# Altium project FMC_ADC_100M_10B_16CHA_TDC.PrjPCB (part 1 of 4)
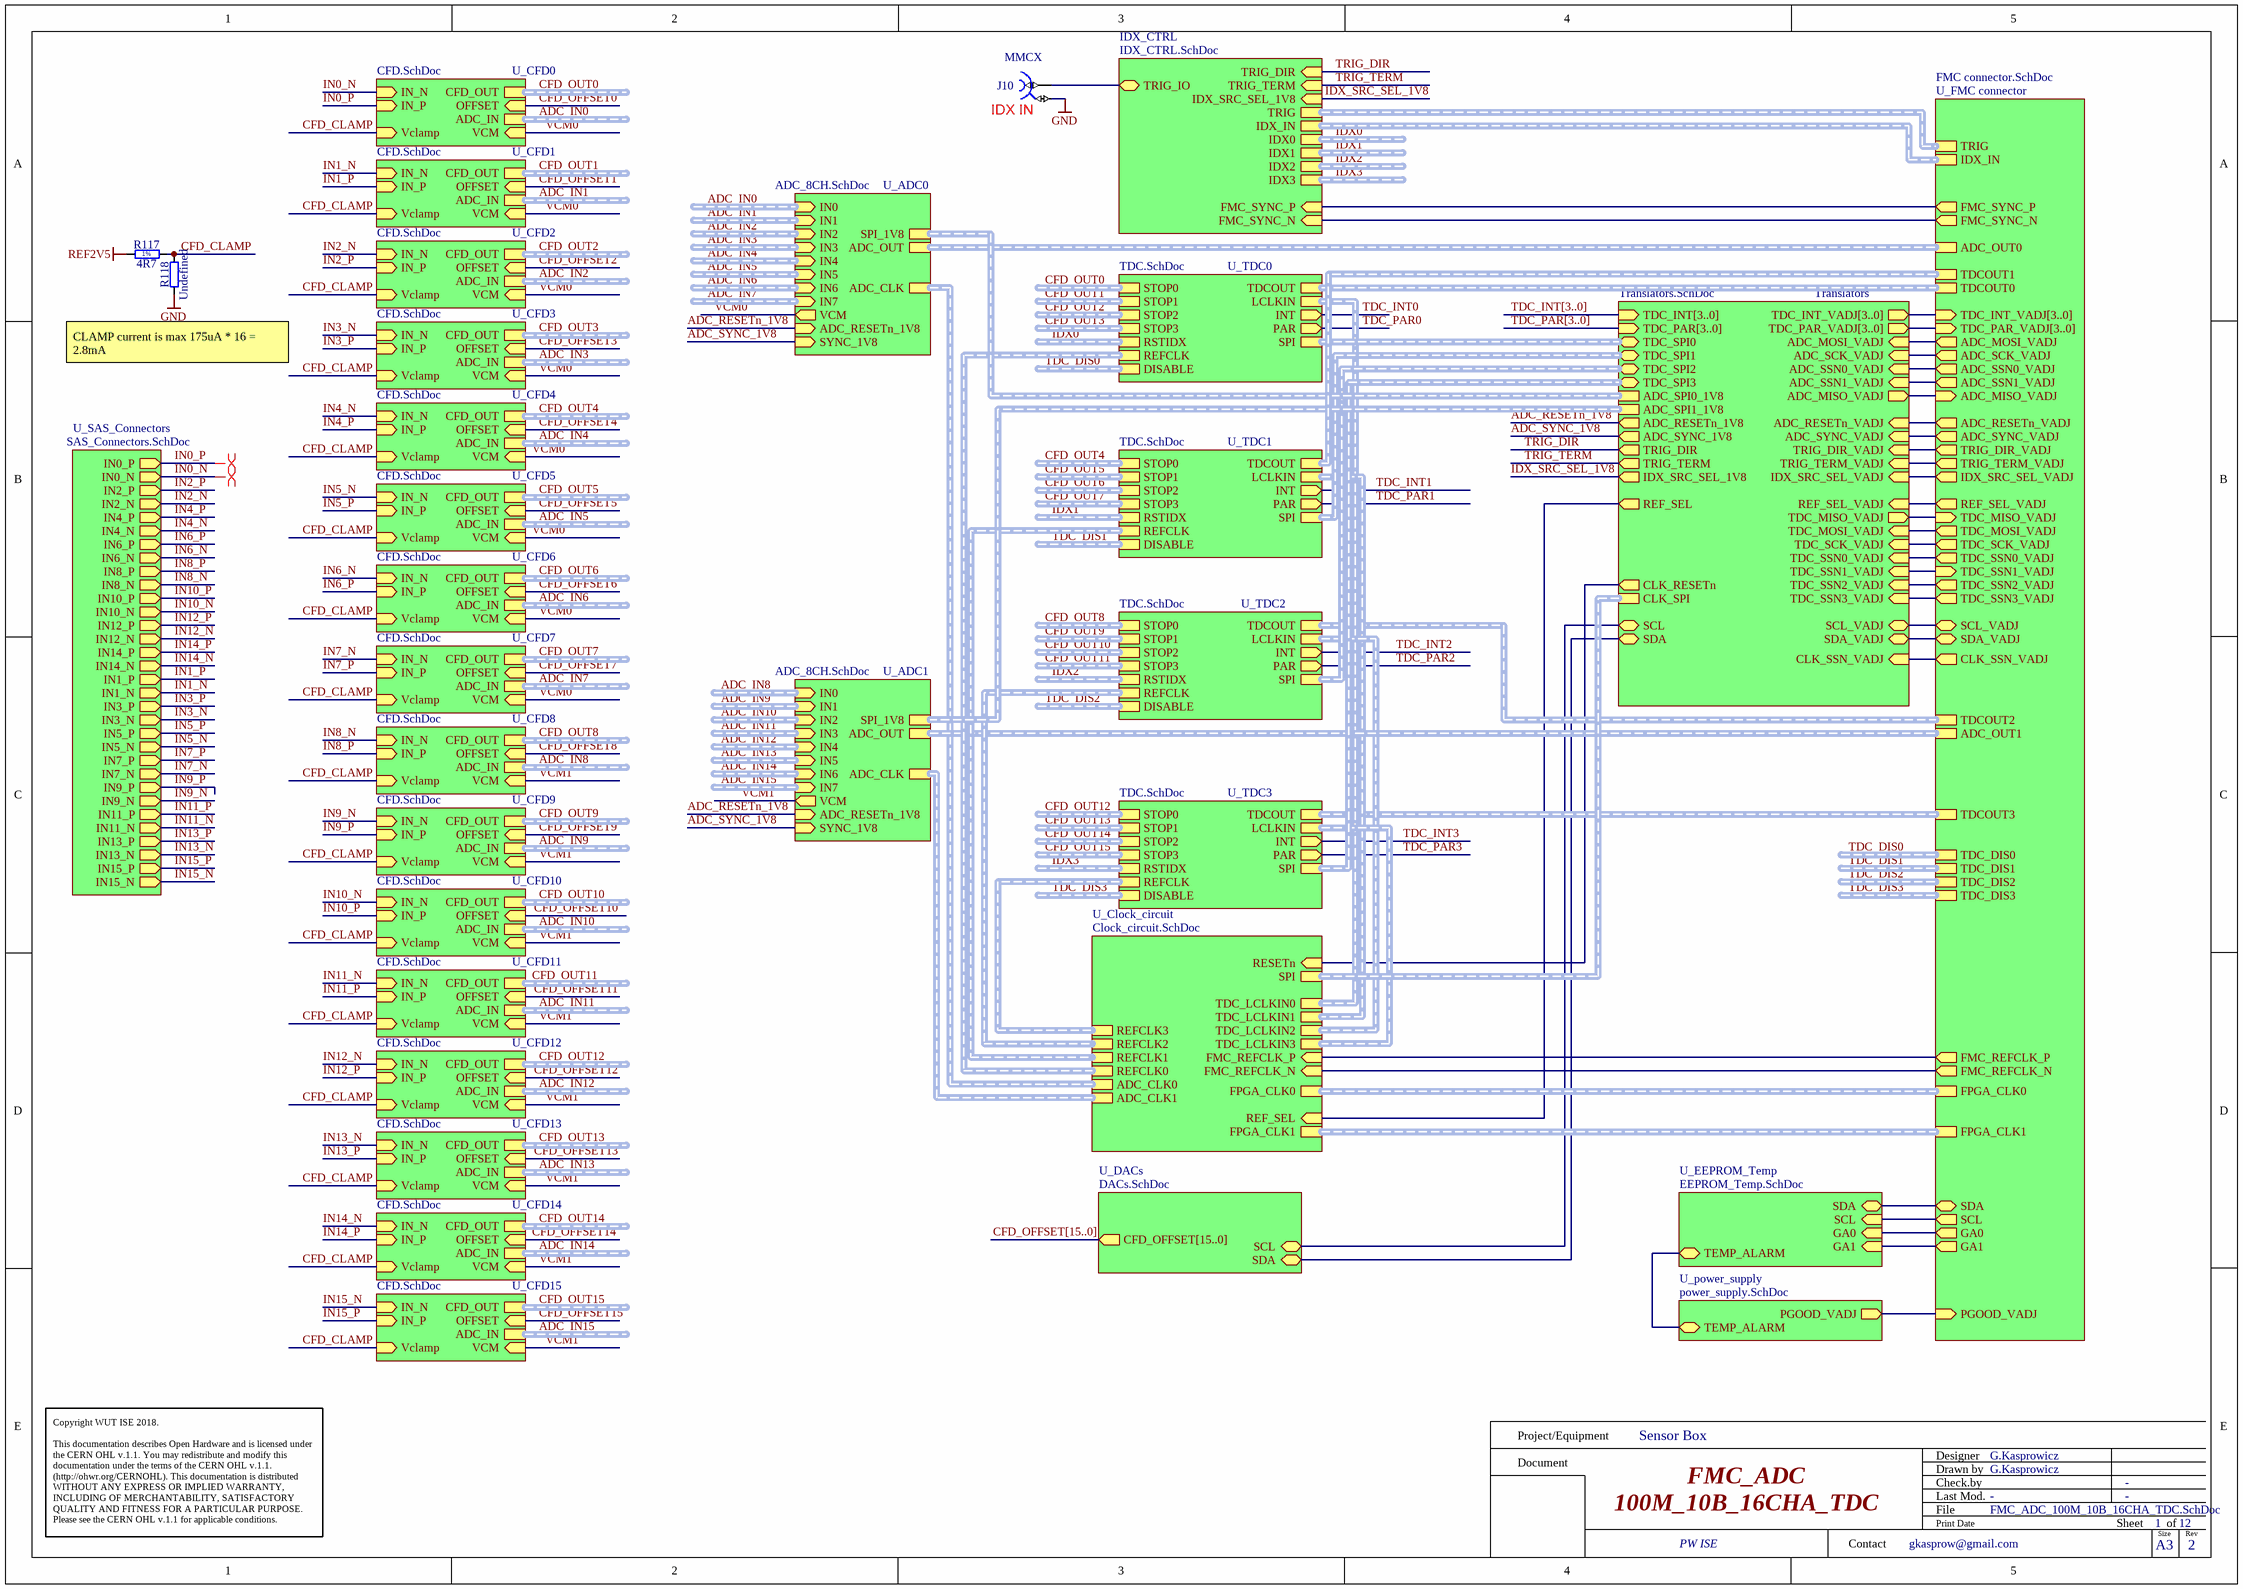
[diagram p0: FMC_ADC_100M_10B_16CHA_TDC.SchDoc]
12 sheets, 720 parts. Net scope: hierarchical (ports join the sheet entries above them; power ports are global).
Board file: FMC_ADC_100M_10B_16CHA_TDC.PcbDoc
Sheets:
  FMC_ADC_100M_10B_16CHA_TDC.SchDoc
    U_ADC0 = ADC_8CH.SchDoc
    U_TDC0 = TDC.SchDoc
    U_Clock_circuit = Clock_circuit.SchDoc
    U_EEPROM_Temp = EEPROM_Temp.SchDoc
    U_FMC connector = FMC connector.SchDoc
    U_power_supply = power_supply.SchDoc
    IDX_CTRL = IDX_CTRL.SchDoc
    U_TDC1 = TDC.SchDoc
    U_TDC2 = TDC.SchDoc
    U_TDC3 = TDC.SchDoc
    U_CFD0 = CFD.SchDoc
    U_DACs = DACs.SchDoc
    U_CFD1 = CFD.SchDoc
    U_CFD2 = CFD.SchDoc
    U_CFD3 = CFD.SchDoc
    U_CFD4 = CFD.SchDoc
    U_CFD5 = CFD.SchDoc
    U_CFD6 = CFD.SchDoc
    U_CFD7 = CFD.SchDoc
    U_CFD8 = CFD.SchDoc
    U_CFD9 = CFD.SchDoc
    U_CFD10 = CFD.SchDoc
    U_CFD11 = CFD.SchDoc
    U_CFD12 = CFD.SchDoc
    U_CFD13 = CFD.SchDoc
    U_CFD14 = CFD.SchDoc
    U_CFD15 = CFD.SchDoc
    U_ADC1 = ADC_8CH.SchDoc
    Translators = Translators.SchDoc
    U_SAS_Connectors = SAS_Connectors.SchDoc

## Sheet FMC_ADC_100M_10B_16CHA_TDC.SchDoc: FMC_ADC
size 420 x 297 mm; Author: G.Kasprowicz; CompanyName: WUT ISE; DrawnBy: G.Kasprowicz; Organization: WUT ISE; Address1: PW ISE; Address2: Nowowiejska 15/19 00-665 Warsaw; Address3: gkasprow@gmail.com; DocumentNumber: 1; Revision: 2; SheetNumber: 1; SheetTotal: 12; ModifiedBy: -; CheckedDate: -; Title2: 100M_10B_16CHA_TDC; DivGrp: WUT ISE; Designer: G.Kasprowicz; ModifiedDate: -; ProjectName: Sensor Box

### Parts
J10  Family: MMCX  [HUBER-SUHNER_85_MMCX-50-0-1/111 OH]  (hidden comment: Coax_1Female_1Shield)
R117  4R7  [RESC1005X40N]
R118  Undefined  [RESC1005X40N]

### Sub-sheets
IDX_CTRL = IDX_CTRL.SchDoc: TRIG_DIR (in), TRIG_TERM (in), IDX1 (harness DIFFSIG), IDX_IN (harness DIFFSIG), IDX2 (harness DIFFSIG), IDX0 (harness DIFFSIG), IDX3 (harness DIFFSIG), TRIG (harness DIFFSIG), TRIG_IO (bidir), IDX_SRC_SEL_1V8 (in), FMC_SYNC_P (in), FMC_SYNC_N (in)
Translators = Translators.SchDoc: TDC_SPI0 (bidir, harness SPI), TDC_SPI1 (bidir, harness SPI), TDC_SPI2 (bidir, harness SPI), TDC_SPI3 (bidir, harness SPI), ADC_SPI0_1V8 (harness SPI), ADC_SPI1_1V8 (harness SPI), ADC_RESETn_1V8 (out), ADC_SYNC_1V8 (out), TRIG_DIR (out), TRIG_TERM (out), IDX_SRC_SEL_1V8 (out), ADC_RESETn_VADJ (in), ADC_SYNC_VADJ (in), TRIG_DIR_VADJ (in), TRIG_TERM_VADJ (in), IDX_SRC_SEL_VADJ (in), REF_SEL (out), REF_SEL_VADJ (in), ADC_SSN0_VADJ (in), ADC_SSN1_VADJ (in), ADC_MISO_VADJ (out), TDC_MISO_VADJ (out), TDC_MOSI_VADJ (in), TDC_SCK_VADJ (in), TDC_SSN1_VADJ (in), ADC_MOSI_VADJ (in), ADC_SCK_VADJ (in), TDC_SSN0_VADJ (in), TDC_SSN2_VADJ (in), TDC_SSN3_VADJ (in), TDC_INT[3..0] (in), TDC_PAR[3..0] (in), TDC_INT_VADJ[3..0] (out), TDC_PAR_VADJ[3..0] (out), SCL (bidir), SDA (bidir), SCL_VADJ (bidir), SDA_VADJ (bidir), CLK_SPI (harness SPI), CLK_RESETn (out), CLK_SSN_VADJ (in)
U_ADC0 = ADC_8CH.SchDoc: ADC_OUT (harness ADC_OUT), VCM (out), ADC_CLK (harness DIFFCLK), IN0 (in, harness DIFFSIG), IN5 (in, harness DIFFSIG), IN6 (in, harness DIFFSIG), IN7 (in, harness DIFFSIG), IN4 (in, harness DIFFSIG), IN2 (in, harness DIFFSIG), IN3 (in, harness DIFFSIG), IN1 (in, harness DIFFSIG), ADC_RESETn_1V8 (in), SYNC_1V8 (in), SPI_1V8 (harness SPI)
U_ADC1 = ADC_8CH.SchDoc: ADC_OUT (harness ADC_OUT), VCM (out), ADC_CLK (harness DIFFCLK), IN0 (in, harness DIFFSIG), IN5 (in, harness DIFFSIG), IN6 (in, harness DIFFSIG), IN7 (in, harness DIFFSIG), IN4 (in, harness DIFFSIG), IN2 (in, harness DIFFSIG), IN3 (in, harness DIFFSIG), IN1 (in, harness DIFFSIG), ADC_RESETn_1V8 (in), SYNC_1V8 (in), SPI_1V8 (harness SPI)
U_CFD0 = CFD.SchDoc: CFD_OUT (harness DIFFSIG), IN_P (in), OFFSET (in), IN_N (in), VCM (in), Vclamp (in), ADC_IN (harness DIFFSIG)
U_CFD1 = CFD.SchDoc: CFD_OUT (harness DIFFSIG), IN_P (in), OFFSET (in), IN_N (in), VCM (in), Vclamp (in), ADC_IN (harness DIFFSIG)
U_CFD2 = CFD.SchDoc: CFD_OUT (harness DIFFSIG), IN_P (in), OFFSET (in), IN_N (in), VCM (in), Vclamp (in), ADC_IN (harness DIFFSIG)
U_CFD3 = CFD.SchDoc: CFD_OUT (harness DIFFSIG), IN_P (in), OFFSET (in), IN_N (in), VCM (in), Vclamp (in), ADC_IN (harness DIFFSIG)
U_CFD4 = CFD.SchDoc: CFD_OUT (harness DIFFSIG), IN_P (in), OFFSET (in), IN_N (in), VCM (in), Vclamp (in), ADC_IN (harness DIFFSIG)
U_CFD5 = CFD.SchDoc: CFD_OUT (harness DIFFSIG), IN_P (in), OFFSET (in), IN_N (in), VCM (in), Vclamp (in), ADC_IN (harness DIFFSIG)
U_CFD6 = CFD.SchDoc: CFD_OUT (harness DIFFSIG), IN_P (in), OFFSET (in), IN_N (in), VCM (in), Vclamp (in), ADC_IN (harness DIFFSIG)
U_CFD7 = CFD.SchDoc: CFD_OUT (harness DIFFSIG), IN_P (in), OFFSET (in), IN_N (in), VCM (in), Vclamp (in), ADC_IN (harness DIFFSIG)
U_CFD8 = CFD.SchDoc: CFD_OUT (harness DIFFSIG), IN_P (in), OFFSET (in), IN_N (in), VCM (in), Vclamp (in), ADC_IN (harness DIFFSIG)
U_CFD9 = CFD.SchDoc: CFD_OUT (harness DIFFSIG), IN_P (in), OFFSET (in), IN_N (in), VCM (in), Vclamp (in), ADC_IN (harness DIFFSIG)
U_CFD10 = CFD.SchDoc: CFD_OUT (harness DIFFSIG), IN_P (in), OFFSET (in), IN_N (in), VCM (in), Vclamp (in), ADC_IN (harness DIFFSIG)
U_CFD11 = CFD.SchDoc: CFD_OUT (harness DIFFSIG), IN_P (in), OFFSET (in), IN_N (in), VCM (in), Vclamp (in), ADC_IN (harness DIFFSIG)
U_CFD12 = CFD.SchDoc: CFD_OUT (harness DIFFSIG), IN_P (in), OFFSET (in), IN_N (in), VCM (in), Vclamp (in), ADC_IN (harness DIFFSIG)
U_CFD13 = CFD.SchDoc: CFD_OUT (harness DIFFSIG), IN_P (in), OFFSET (in), IN_N (in), VCM (in), Vclamp (in), ADC_IN (harness DIFFSIG)
U_CFD14 = CFD.SchDoc: CFD_OUT (harness DIFFSIG), IN_P (in), OFFSET (in), IN_N (in), VCM (in), Vclamp (in), ADC_IN (harness DIFFSIG)
U_CFD15 = CFD.SchDoc: CFD_OUT (harness DIFFSIG), IN_P (in), OFFSET (in), IN_N (in), VCM (in), Vclamp (in), ADC_IN (harness DIFFSIG)
U_Clock_circuit = Clock_circuit.SchDoc: FMC_REFCLK_P (in), FMC_REFCLK_N (in), TDC_LCLKIN0 (harness DIFFCLK), TDC_LCLKIN1 (harness DIFFCLK), TDC_LCLKIN2 (harness DIFFCLK), TDC_LCLKIN3 (harness DIFFCLK), ADC_CLK0 (harness DIFFCLK), ADC_CLK1 (harness DIFFCLK), REFCLK0 (harness DIFFCLK), REFCLK1 (harness DIFFCLK), REFCLK2 (harness DIFFCLK), REFCLK3 (harness DIFFCLK), FPGA_CLK0 (harness DIFFCLK), REF_SEL (in), FPGA_CLK1 (harness DIFFCLK), RESETn (in), SPI (harness SPI)
U_DACs = DACs.SchDoc: SDA (bidir), SCL (bidir), CFD_OFFSET[15..0] (out)
U_EEPROM_Temp = EEPROM_Temp.SchDoc: SDA (bidir), SCL (in), GA0 (in), GA1 (in), TEMP_ALARM (bidir)
U_FMC connector = FMC connector.SchDoc: SDA (bidir), GA1 (out), GA0 (out), SCL (out), FMC_REFCLK_P (out), FMC_REFCLK_N (out), TDCOUT0 (harness TDCOUT), TDCOUT1 (harness TDCOUT), TDCOUT2 (harness TDCOUT), TDCOUT3 (harness TDCOUT), ADC_OUT0 (harness ADC_OUT), ADC_OUT1 (harness ADC_OUT), TRIG (harness DIFFSIG), IDX_IN (harness DIFFSIG), FPGA_CLK0 (harness DIFFCLK), FPGA_CLK1 (harness DIFFCLK), ADC_RESETn_VADJ (out), ADC_SYNC_VADJ (out), TRIG_DIR_VADJ (out), TRIG_TERM_VADJ (out), IDX_SRC_SEL_VADJ (out), REF_SEL_VADJ (out), PGOOD_VADJ (in), ADC_MISO_VADJ (in), ADC_MOSI_VADJ (out), ADC_SCK_VADJ (out), ADC_SSN0_VADJ (out), ADC_SSN1_VADJ (out), TDC_MISO_VADJ (in), TDC_MOSI_VADJ (out), TDC_SCK_VADJ (out), TDC_SSN0_VADJ (out), TDC_SSN1_VADJ (in), TDC_SSN2_VADJ (out), TDC_SSN3_VADJ (out), TDC_DIS0 (harness DIFFSIG), TDC_DIS1 (harness DIFFSIG), TDC_DIS2 (harness DIFFSIG), TDC_DIS3 (harness DIFFSIG), TDC_INT_VADJ[3..0] (in), TDC_PAR_VADJ[3..0] (in), SCL_VADJ (bidir), SDA_VADJ (bidir), CLK_SSN_VADJ (out), FMC_SYNC_P (out), FMC_SYNC_N (out)
U_power_supply = power_supply.SchDoc: PGOOD_VADJ (out), TEMP_ALARM (bidir)
U_SAS_Connectors = SAS_Connectors.SchDoc: IN0_P (out), IN0_N (out), IN2_P (out), IN2_N (out), IN4_P (out), IN4_N (out), IN6_P (out), IN6_N (out), IN8_P (out), IN8_N (out), IN10_P (out), IN10_N (out), IN12_P (out), IN12_N (out), IN14_P (out), IN14_N (out), IN1_P (out), IN1_N (out), IN3_P (out), IN3_N (out), IN5_P (out), IN5_N (out), IN7_P (out), IN7_N (out), IN9_P (out), IN9_N (out), IN11_P (out), IN11_N (out), IN13_P (out), IN13_N (out), IN15_P (out), IN15_N (out)
U_TDC0 = TDC.SchDoc: LCLKIN (harness DIFFCLK), DISABLE (harness DIFFSIG), REFCLK (harness DIFFCLK), SPI (harness SPI), STOP1 (harness DIFFSIG), INT (out), RSTIDX (harness DIFFSIG), STOP3 (harness DIFFSIG), TDCOUT (harness TDCOUT), PAR (out), STOP0 (harness DIFFSIG), STOP2 (harness DIFFSIG)
U_TDC1 = TDC.SchDoc: LCLKIN (harness DIFFCLK), DISABLE (harness DIFFSIG), REFCLK (harness DIFFCLK), SPI (harness SPI), INT (out), RSTIDX (harness DIFFSIG), TDCOUT (harness TDCOUT), PAR (out), STOP1 (harness DIFFSIG), STOP3 (harness DIFFSIG), STOP0 (harness DIFFSIG), STOP2 (harness DIFFSIG)
U_TDC2 = TDC.SchDoc: LCLKIN (harness DIFFCLK), DISABLE (harness DIFFSIG), REFCLK (harness DIFFCLK), SPI (harness SPI), INT (out), RSTIDX (harness DIFFSIG), TDCOUT (harness TDCOUT), PAR (out), STOP1 (harness DIFFSIG), STOP3 (harness DIFFSIG), STOP0 (harness DIFFSIG), STOP2 (harness DIFFSIG)
U_TDC3 = TDC.SchDoc: LCLKIN (harness DIFFCLK), DISABLE (harness DIFFSIG), REFCLK (harness DIFFCLK), SPI (harness SPI), INT (out), RSTIDX (harness DIFFSIG), TDCOUT (harness TDCOUT), PAR (out), STOP1 (harness DIFFSIG), STOP3 (harness DIFFSIG), STOP0 (harness DIFFSIG), STOP2 (harness DIFFSIG)

### Nets
GND: J10.2 R118.1
REF2V5: R117.1
ADC_MISO_VADJ: sheet U_FMC connector/ADC_MISO_VADJ, sheet Translators/ADC_MISO_VADJ
ADC_MOSI_VADJ: sheet U_FMC connector/ADC_MOSI_VADJ, sheet Translators/ADC_MOSI_VADJ
ADC_RESETn_1V8: sheet U_ADC0/ADC_RESETn_1V8, sheet U_ADC1/ADC_RESETn_1V8, sheet Translators/ADC_RESETn_1V8
ADC_SCK_VADJ: sheet U_FMC connector/ADC_SCK_VADJ, sheet Translators/ADC_SCK_VADJ
ADC_SSN0_VADJ: sheet U_FMC connector/ADC_SSN0_VADJ, sheet Translators/ADC_SSN0_VADJ
ADC_SSN1_VADJ: sheet U_FMC connector/ADC_SSN1_VADJ, sheet Translators/ADC_SSN1_VADJ
ADC_SYNC_1V8: sheet U_ADC0/SYNC_1V8, sheet U_ADC1/SYNC_1V8, sheet Translators/ADC_SYNC_1V8
CFD_CLAMP: R117.2 R118.2 ; sheet U_CFD0/Vclamp, sheet U_CFD1/Vclamp, sheet U_CFD2/Vclamp, sheet U_CFD3/Vclamp, sheet U_CFD4/Vclamp, sheet U_CFD5/Vclamp, sheet U_CFD6/Vclamp, sheet U_CFD7/Vclamp, sheet U_CFD8/Vclamp, sheet U_CFD9/Vclamp, sheet U_CFD10/Vclamp, sheet U_CFD11/Vclamp, sheet U_CFD12/Vclamp, sheet U_CFD13/Vclamp, sheet U_CFD14/Vclamp, sheet U_CFD15/Vclamp
CLK2_BIDIR_N: sheet U_FMC connector/FMC_SYNC_N, sheet IDX_CTRL/FMC_SYNC_N
CLK2_BIDIR_P: sheet U_FMC connector/FMC_SYNC_P, sheet IDX_CTRL/FMC_SYNC_P
DAC_SCL: sheet U_DACs/SCL, sheet Translators/SCL
DAC_SDA: sheet U_DACs/SDA, sheet Translators/SDA
GA0: sheet U_EEPROM_Temp/GA0, sheet U_FMC connector/GA0
GA1: sheet U_EEPROM_Temp/GA1, sheet U_FMC connector/GA1
HA20_N: sheet U_FMC connector/TDC_SSN3_VADJ, sheet Translators/TDC_SSN3_VADJ
IDX_SRC_SEL_1V8: sheet IDX_CTRL/IDX_SRC_SEL_1V8, sheet Translators/IDX_SRC_SEL_1V8
IN0_N: sheet U_CFD0/IN_N, sheet U_SAS_Connectors/IN0_N
IN0_P: sheet U_CFD0/IN_P, sheet U_SAS_Connectors/IN0_P
IN1_N: sheet U_CFD1/IN_N, sheet U_SAS_Connectors/IN1_N
IN1_P: sheet U_CFD1/IN_P, sheet U_SAS_Connectors/IN1_P
IN2_N: sheet U_CFD2/IN_N, sheet U_SAS_Connectors/IN2_N
IN2_P: sheet U_CFD2/IN_P, sheet U_SAS_Connectors/IN2_P
IN3_N: sheet U_CFD3/IN_N, sheet U_SAS_Connectors/IN3_N
IN3_P: sheet U_CFD3/IN_P, sheet U_SAS_Connectors/IN3_P
IN4_N: sheet U_CFD4/IN_N, sheet U_SAS_Connectors/IN4_N
IN4_P: sheet U_CFD4/IN_P, sheet U_SAS_Connectors/IN4_P
IN5_N: sheet U_CFD5/IN_N, sheet U_SAS_Connectors/IN5_N
IN5_P: sheet U_CFD5/IN_P, sheet U_SAS_Connectors/IN5_P
IN6_N: sheet U_CFD6/IN_N, sheet U_SAS_Connectors/IN6_N
IN6_P: sheet U_CFD6/IN_P, sheet U_SAS_Connectors/IN6_P
IN7_N: sheet U_CFD7/IN_N, sheet U_SAS_Connectors/IN7_N
IN7_P: sheet U_CFD7/IN_P, sheet U_SAS_Connectors/IN7_P
IN8_N: sheet U_CFD8/IN_N, sheet U_SAS_Connectors/IN8_N
IN8_P: sheet U_CFD8/IN_P, sheet U_SAS_Connectors/IN8_P
IN9_N: sheet U_CFD9/IN_N, sheet U_SAS_Connectors/IN9_N
IN9_P: sheet U_CFD9/IN_P, sheet U_SAS_Connectors/IN9_P
IN10_N: sheet U_CFD10/IN_N, sheet U_SAS_Connectors/IN10_N
IN10_P: sheet U_CFD10/IN_P, sheet U_SAS_Connectors/IN10_P
IN11_N: sheet U_CFD11/IN_N, sheet U_SAS_Connectors/IN11_N
IN11_P: sheet U_CFD11/IN_P, sheet U_SAS_Connectors/IN11_P
IN12_N: sheet U_CFD12/IN_N, sheet U_SAS_Connectors/IN12_N
IN12_P: sheet U_CFD12/IN_P, sheet U_SAS_Connectors/IN12_P
IN13_N: sheet U_CFD13/IN_N, sheet U_SAS_Connectors/IN13_N
IN13_P: sheet U_CFD13/IN_P, sheet U_SAS_Connectors/IN13_P
IN14_N: sheet U_CFD14/IN_N, sheet U_SAS_Connectors/IN14_N
IN14_P: sheet U_CFD14/IN_P, sheet U_SAS_Connectors/IN14_P
IN15_N: sheet U_CFD15/IN_N, sheet U_SAS_Connectors/IN15_N
IN15_P: sheet U_CFD15/IN_P, sheet U_SAS_Connectors/IN15_P
LA12_P: sheet U_FMC connector/TDC_SSN2_VADJ, sheet Translators/TDC_SSN2_VADJ
LA13_N: sheet U_FMC connector/TRIG_DIR_VADJ, sheet Translators/TRIG_DIR_VADJ
LA13_P: sheet U_FMC connector/TDC_MOSI_VADJ, sheet Translators/TDC_MOSI_VADJ
LA14_N: sheet U_FMC connector/CLK_SSN_VADJ, sheet Translators/CLK_SSN_VADJ
LA14_P: sheet U_FMC connector/TRIG_TERM_VADJ, sheet Translators/TRIG_TERM_VADJ
LA15_N: sheet U_FMC connector/TDC_SCK_VADJ, sheet Translators/TDC_SCK_VADJ
LA15_P: sheet U_FMC connector/ADC_RESETn_VADJ, sheet Translators/ADC_RESETn_VADJ
LA16_N: sheet U_FMC connector/TDC_MISO_VADJ, sheet Translators/TDC_MISO_VADJ
LA27_N: sheet U_FMC connector/SCL_VADJ, sheet Translators/SCL_VADJ
LA27_P: sheet U_FMC connector/SDA_VADJ, sheet Translators/SDA_VADJ
LA29_N: sheet U_FMC connector/PGOOD_VADJ, sheet U_power_supply/PGOOD_VADJ
LA29_P: sheet U_FMC connector/REF_SEL_VADJ, sheet Translators/REF_SEL_VADJ
LA30_N: sheet U_FMC connector/IDX_SRC_SEL_VADJ, sheet Translators/IDX_SRC_SEL_VADJ
LA30_P: sheet U_FMC connector/ADC_SYNC_VADJ, sheet Translators/ADC_SYNC_VADJ
LA31_N: sheet U_FMC connector/TDC_SSN0_VADJ, sheet Translators/TDC_SSN0_VADJ
LA31_P: sheet U_FMC connector/TDC_SSN1_VADJ, sheet Translators/TDC_SSN1_VADJ
REF_SEL: sheet U_Clock_circuit/REF_SEL, sheet Translators/REF_SEL
REFA_N: sheet U_Clock_circuit/FMC_REFCLK_N, sheet U_FMC connector/FMC_REFCLK_N
REFA_P: sheet U_Clock_circuit/FMC_REFCLK_P, sheet U_FMC connector/FMC_REFCLK_P
SCL: sheet U_EEPROM_Temp/SCL, sheet U_FMC connector/SCL
SDA: sheet U_EEPROM_Temp/SDA, sheet U_FMC connector/SDA
TEMP_ALARM: sheet U_EEPROM_Temp/TEMP_ALARM, sheet U_power_supply/TEMP_ALARM
TRIG_DIR: sheet IDX_CTRL/TRIG_DIR, sheet Translators/TRIG_DIR
TRIG_TERM: sheet IDX_CTRL/TRIG_TERM, sheet Translators/TRIG_TERM
VCM0: sheet U_ADC0/VCM, sheet U_CFD0/VCM, sheet U_CFD1/VCM, sheet U_CFD2/VCM, sheet U_CFD3/VCM, sheet U_CFD4/VCM, sheet U_CFD5/VCM, sheet U_CFD6/VCM, sheet U_CFD7/VCM
VCM1: sheet U_CFD8/VCM, sheet U_CFD9/VCM, sheet U_CFD10/VCM, sheet U_CFD11/VCM, sheet U_CFD12/VCM, sheet U_CFD13/VCM, sheet U_CFD14/VCM, sheet U_CFD15/VCM, sheet U_ADC1/VCM
NetD3_3: J10.1 ; sheet IDX_CTRL/TRIG_IO
NetIC5_13: sheet U_Clock_circuit/RESETn, sheet Translators/CLK_RESETn

### Buses and harness runs
bus CFD_OFFSET[15..0] = sheet U_DACs/CFD_OFFSET[15..0]
bus sheet Translators/TDC_INT_VADJ[3..0] = sheet U_FMC connector/TDC_INT_VADJ[3..0]
bus sheet Translators/TDC_PAR_VADJ[3..0] = sheet U_FMC connector/TDC_PAR_VADJ[3..0]
bus TDC_INT[3..0] = sheet Translators/TDC_INT[3..0]
bus TDC_PAR[3..0] = sheet Translators/TDC_PAR[3..0]
harness ADC_IN0 = sheet U_ADC0/IN0
harness ADC_IN0 = sheet U_CFD0/ADC_IN
harness ADC_IN1 = sheet U_ADC0/IN1
harness ADC_IN1 = sheet U_CFD1/ADC_IN
harness ADC_IN2 = sheet U_ADC0/IN2
harness ADC_IN2 = sheet U_CFD2/ADC_IN
harness ADC_IN3 = sheet U_ADC0/IN3
harness ADC_IN3 = sheet U_CFD3/ADC_IN
harness ADC_IN4 = sheet U_ADC0/IN4
harness ADC_IN4 = sheet U_CFD4/ADC_IN
harness ADC_IN5 = sheet U_ADC0/IN5
harness ADC_IN5 = sheet U_CFD5/ADC_IN
harness ADC_IN6 = sheet U_ADC0/IN6
harness ADC_IN6 = sheet U_CFD6/ADC_IN
harness ADC_IN7 = sheet U_ADC0/IN7
harness ADC_IN7 = sheet U_CFD7/ADC_IN
harness ADC_IN8 = sheet U_ADC1/IN0
harness ADC_IN8 = sheet U_CFD8/ADC_IN
harness ADC_IN9 = sheet U_ADC1/IN1
harness ADC_IN9 = sheet U_CFD9/ADC_IN
harness ADC_IN10 = sheet U_ADC1/IN2
harness ADC_IN10 = sheet U_CFD10/ADC_IN
harness ADC_IN11 = sheet U_ADC1/IN3
harness ADC_IN11 = sheet U_CFD11/ADC_IN
harness ADC_IN12 = sheet U_ADC1/IN4
harness ADC_IN12 = sheet U_CFD12/ADC_IN
harness ADC_IN13 = sheet U_ADC1/IN5
harness ADC_IN13 = sheet U_CFD13/ADC_IN
harness ADC_IN14 = sheet U_ADC1/IN6
harness ADC_IN14 = sheet U_CFD14/ADC_IN
harness ADC_IN15 = sheet U_ADC1/IN7
harness ADC_IN15 = sheet U_CFD15/ADC_IN
harness CFD_OUT0 = sheet U_CFD0/CFD_OUT
harness CFD_OUT0 = sheet U_TDC0/STOP0
harness CFD_OUT1 = sheet U_CFD1/CFD_OUT
harness CFD_OUT1 = sheet U_TDC0/STOP1
harness CFD_OUT2 = sheet U_CFD2/CFD_OUT
harness CFD_OUT2 = sheet U_TDC0/STOP2
harness CFD_OUT3 = sheet U_CFD3/CFD_OUT
harness CFD_OUT3 = sheet U_TDC0/STOP3
harness CFD_OUT4 = sheet U_CFD4/CFD_OUT
harness CFD_OUT4 = sheet U_TDC1/STOP0
harness CFD_OUT5 = sheet U_CFD5/CFD_OUT
harness CFD_OUT5 = sheet U_TDC1/STOP1
harness CFD_OUT6 = sheet U_CFD6/CFD_OUT
harness CFD_OUT6 = sheet U_TDC1/STOP2
harness CFD_OUT7 = sheet U_CFD7/CFD_OUT
harness CFD_OUT7 = sheet U_TDC1/STOP3
harness CFD_OUT8 = sheet U_CFD8/CFD_OUT
harness CFD_OUT8 = sheet U_TDC2/STOP0
harness CFD_OUT9 = sheet U_CFD9/CFD_OUT
harness CFD_OUT9 = sheet U_TDC2/STOP1
harness CFD_OUT10 = sheet U_CFD10/CFD_OUT
harness CFD_OUT10 = sheet U_TDC2/STOP2
harness CFD_OUT11 = sheet U_CFD11/CFD_OUT
harness CFD_OUT11 = sheet U_TDC2/STOP3
harness CFD_OUT12 = sheet U_CFD12/CFD_OUT
harness CFD_OUT12 = sheet U_TDC3/STOP0
harness CFD_OUT13 = sheet U_CFD13/CFD_OUT
harness CFD_OUT13 = sheet U_TDC3/STOP1
harness CFD_OUT14 = sheet U_CFD14/CFD_OUT
harness CFD_OUT14 = sheet U_TDC3/STOP2
harness CFD_OUT15 = sheet U_CFD15/CFD_OUT
harness CFD_OUT15 = sheet U_TDC3/STOP3
harness IDX0 = sheet IDX_CTRL/IDX0
harness IDX0 = sheet U_TDC0/RSTIDX
harness IDX1 = sheet IDX_CTRL/IDX1
harness IDX1 = sheet U_TDC1/RSTIDX
harness IDX2 = sheet IDX_CTRL/IDX2
harness IDX2 = sheet U_TDC2/RSTIDX
harness IDX3 = sheet IDX_CTRL/IDX3
harness IDX3 = sheet U_TDC3/RSTIDX
harness sheet IDX_CTRL/IDX_IN = sheet U_FMC connector/IDX_IN
harness sheet IDX_CTRL/TRIG = sheet U_FMC connector/TRIG
harness sheet Translators/ADC_SPI0_1V8 = sheet U_ADC0/SPI_1V8
harness sheet Translators/ADC_SPI1_1V8 = sheet U_ADC1/SPI_1V8
harness sheet Translators/CLK_SPI = sheet U_Clock_circuit/SPI
harness sheet Translators/TDC_SPI0 = sheet U_TDC0/SPI
harness sheet Translators/TDC_SPI1 = sheet U_TDC1/SPI
harness sheet Translators/TDC_SPI2 = sheet U_TDC2/SPI
harness sheet Translators/TDC_SPI3 = sheet U_TDC3/SPI
harness sheet U_ADC0/ADC_CLK = sheet U_Clock_circuit/ADC_CLK0
harness sheet U_ADC0/ADC_OUT = sheet U_FMC connector/ADC_OUT0
harness sheet U_ADC1/ADC_CLK = sheet U_Clock_circuit/ADC_CLK1
harness sheet U_ADC1/ADC_OUT = sheet U_FMC connector/ADC_OUT1
harness sheet U_Clock_circuit/FPGA_CLK0 = sheet U_FMC connector/FPGA_CLK0
harness sheet U_Clock_circuit/FPGA_CLK1 = sheet U_FMC connector/FPGA_CLK1
harness sheet U_Clock_circuit/REFCLK0 = sheet U_TDC0/REFCLK
harness sheet U_Clock_circuit/REFCLK1 = sheet U_TDC1/REFCLK
harness sheet U_Clock_circuit/REFCLK2 = sheet U_TDC2/REFCLK
harness sheet U_Clock_circuit/REFCLK3 = sheet U_TDC3/REFCLK
harness sheet U_Clock_circuit/TDC_LCLKIN0 = sheet U_TDC0/LCLKIN
harness sheet U_Clock_circuit/TDC_LCLKIN1 = sheet U_TDC1/LCLKIN
harness sheet U_Clock_circuit/TDC_LCLKIN2 = sheet U_TDC2/LCLKIN
harness sheet U_Clock_circuit/TDC_LCLKIN3 = sheet U_TDC3/LCLKIN
harness sheet U_FMC connector/TDCOUT0 = sheet U_TDC0/TDCOUT
harness sheet U_FMC connector/TDCOUT1 = sheet U_TDC1/TDCOUT
harness sheet U_FMC connector/TDCOUT2 = sheet U_TDC2/TDCOUT
harness sheet U_FMC connector/TDCOUT3 = sheet U_TDC3/TDCOUT
harness TDC_DIS0 = sheet U_FMC connector/TDC_DIS0
harness TDC_DIS0 = sheet U_TDC0/DISABLE
harness TDC_DIS1 = sheet U_FMC connector/TDC_DIS1
harness TDC_DIS1 = sheet U_TDC1/DISABLE
harness TDC_DIS2 = sheet U_FMC connector/TDC_DIS2
harness TDC_DIS2 = sheet U_TDC2/DISABLE
harness TDC_DIS3 = sheet U_FMC connector/TDC_DIS3
harness TDC_DIS3 = sheet U_TDC3/DISABLE

### Layout directives
differential pair: IN0_N, IN0_P

### Notes on the sheet
- (near J10) IDX IN
- (near R118) CLAMP current is max 175uA * 16 = 2.8mA
- Project/Equipment
- Document
- Designer
- Drawn by
- Check.by
- Copyright WUT ISE 2018.
  This documentation describes Open Hardware and is licensed under the CERN OHL v.1.1. You may redistribute and modify this documentation under the terms of the CERN OHL v.1.1. (http://ohwr.org/CERNOHL). This documentation is distributed WITHOUT ANY EXPRESS OR IMPLIED WARRANTY, INCLUDING OF MERCHANTABILITY, SATISFACTORY QUALITY AND FITNESS FOR A PARTICULAR PURPOSE. Please see the CERN OHL v.1.1 for applicable conditions.
- Contact
- File
- Last Mod.
- Print Date
- Sheet
- Size
- A3
- of
- Rev
- (in symbol R0402_4R7_1%_0.0625W_200PPM) 1%

### Library data of the parts
J10 = HUBER-SUHNER_85_MMCX-50-0-1/111 OH: Part Description: MMCX 50 Ohms Right Angle PCB Jack; Manufacturer: HUBER+SUHNER; Table: Miscellaneous; Part Number: HUBER-SUHNER_85_MMCX-50-0-1/111 OH; Component Kind: Standard; Component Type: Standard; Pin Count: 2; Mounted: Yes; Socket: No; SMD: No; Status: None; Manufacturer Part Number: 85_MMCX-50-0-1/111 OH; ComponentHeight: 9.6mm; HelpURL: \\cern.ch\dfs\Applications\Altium\Datasheets\HUBER-SUHNER_85_MMCX-50-0-1-111 OH.pdf; Author: CERN DEM JLC; CreateDate: 2011-10-04; LatestRevisionDate: 2011-10-04
R117 = R0402_4R7_1%_0.0625W_200PPM: Resistor - 1%; Part Description: General Purpose Thick Film Chip Resistor; Manufacturer: GENERIC; Manufacturer1 Part Number: 232270674708L; TC: ±200ppm/°C; PressFit: No; Part Number: R0402_4R7_1%_0.0625W_200PPM; Component Kind: Standard; Component Type: Standard; Pin Count: 2; Value: 4R7; Status: Not Recommended; Power: 0.0625W; Tolerance: ±1%; Manufacturer Part Number: R0402_4R7_1%_0.0625W_200PPM; Case: 0402; Mounted: Yes; Sense: No; Socket: No; SMD: Yes; Manufacturer1 Example: YAGEO PHYCOMP; Manufacturer1 ComponentHeight: 0.4mm; HelpURL: \\cern.ch\dfs\Applications\Altium\Datasheets\R0402_Phycomp_RC0402.pdf; Author: CERN DEM JLC; CreateDate: 03.12.2007; LatestRevisionDate: 17.10.2012
R118 = R0402_NO-VALUE: Resistor; Part Description: Reserved Footprint For a 0402 (1005) Chip Resistor; PressFit: No; Mounted: No; Part Number: R0402_NO-VALUE; Component Kind: Standard; Component Type: Standard; Pin Count: 2; Value: Undefined; Status: None; Manufacturer: Undefined; Manufacturer Part Number: R0402_NO-VALUE; Case: 0402; Sense: No; Socket: No; SMD: Yes; Manufacturer1 Example: Undefined; Manufacturer1 Part Number: Undefined; Manufacturer1 ComponentHeight: Undefined; HelpURL: Undefined; Author: CERN DEM JLC; CreateDate: 03.12.2007; LatestRevisionDate: 13.03.2008

## Sheet ADC_8CH.SchDoc: FMC_ADC
size 420 x 297 mm; Author: G.Kasprowicz; CompanyName: WUT ISE; DrawnBy: G.Kasprowicz; Organization: WUT ISE; Address1: PW ISE; Address2: Nowowiejska 15/19 00-665 Warsaw; Address3: gkasprow@gmail.com; DocumentNumber: 5; Revision: 2; SheetNumber: 5; SheetTotal: 12; ModifiedBy: -; CheckedDate: -; Title2: ADC; DivGrp: WUT ISE; Designer: G.Kasprowicz; ModifiedDate: -; ProjectName: Sensor Box
Used 2 times, as channels U_ADC0, U_ADC1. Parts and nets are listed once, with the designators drawn on the sheet.
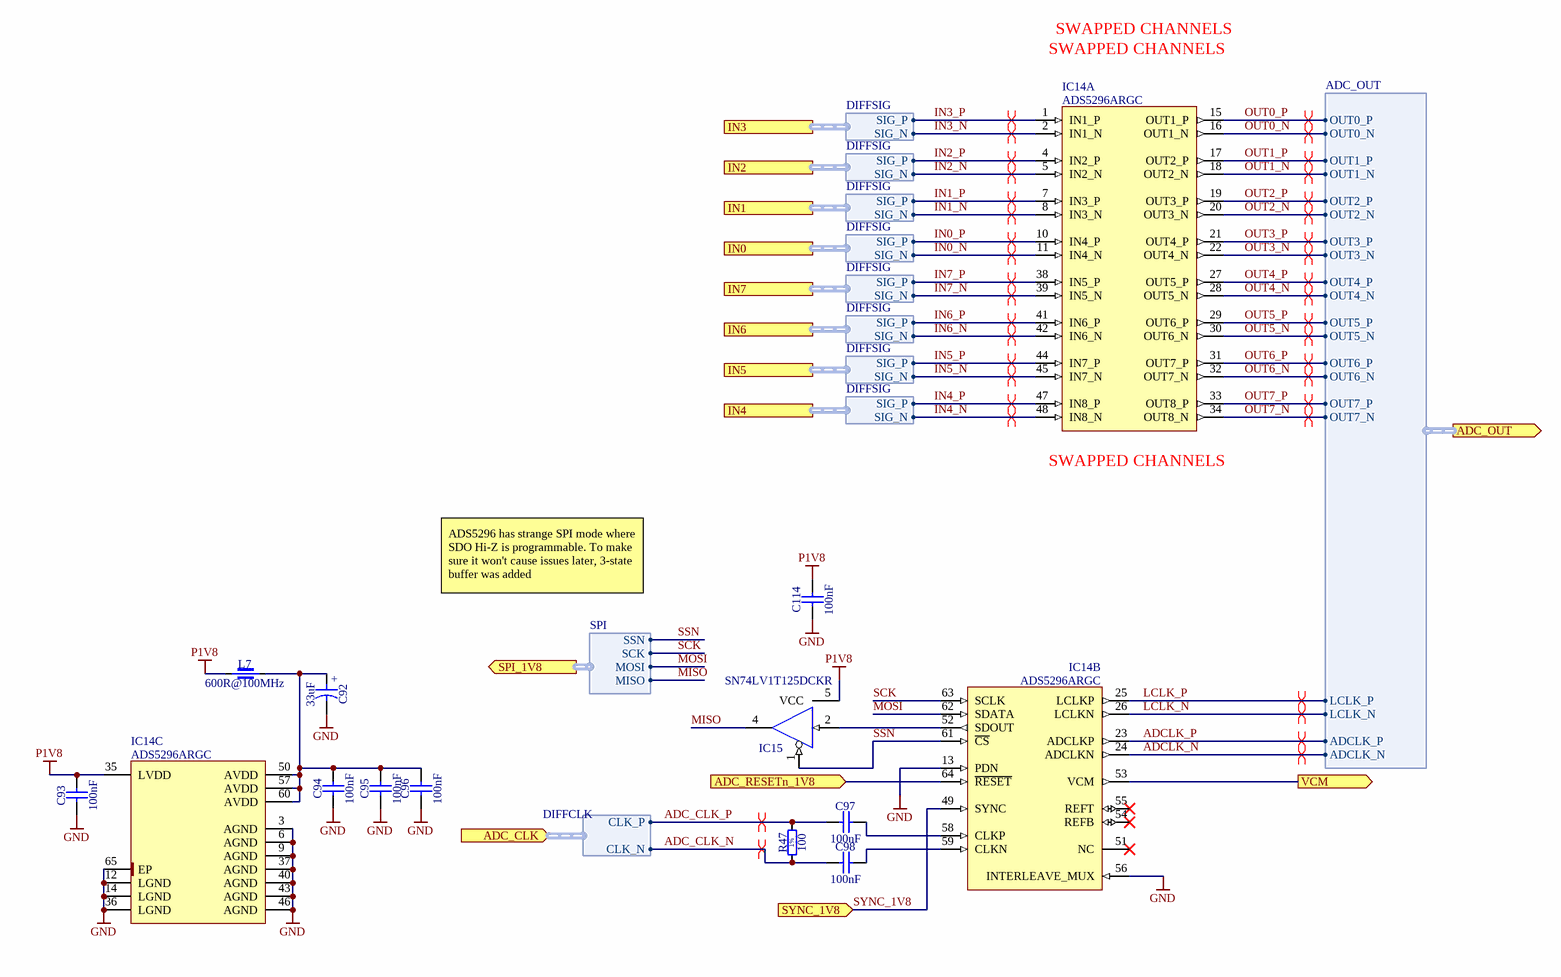
[diagram p1: ADC_8CH.SchDoc]

### Parts
C92  33uF  [CAPMP3216X180N]
C93  100nF  [CAPC0603X33N]
C94  100nF  [CAPC0603X33N]
C95  100nF  [CAPC0603X33N]
C96  100nF  [CAPC0603X33N]
C97  100nF  [CAPC0603X33N]
C98  100nF  [CAPC0603X33N]
C114  100nF  [CAPC0603X33N]
IC14  ADS5296ARGC  [QFN50P900X900X100-65N-S735]  (parts A,B,C of 3)
IC15  SN74LV1T125DCKR  [SOT65P210X110-5N]
L7  600R@100MHz  [INDC1005X55N]
R47  100  [RESC0603X28N]

### Ports
ADC_CLK (in, harness DIFFCLK), ADC_OUT (out, harness ADC_OUT), ADC_RESETn_1V8 (in), IN0 (harness DIFFSIG), IN1 (harness DIFFSIG), IN2 (harness DIFFSIG), IN3 (harness DIFFSIG), IN4 (harness DIFFSIG), IN5 (harness DIFFSIG), IN6 (harness DIFFSIG), IN7 (harness DIFFSIG), SPI_1V8 (out, harness SPI), SYNC_1V8 (in), VCM (out)

### Harnesses
ADC_OUT: LCLK_P, LCLK_N, ADCLK_P, ADCLK_N, OUT1_N, OUT2_N, OUT3_N, OUT4_N, OUT5_N, OUT1_P, OUT2_P, OUT3_P, OUT4_P, OUT5_P, OUT0_P, OUT0_N, OUT6_P, OUT6_N, OUT7_P, OUT7_N
SPI: MISO, MOSI, SCK, SSN
DIFFCLK: CLK_P, CLK_N
DIFFSIG: SIG_P, SIG_N

### Nets
GND: C92.2 C93.1 C94.1 C95.1 C96.1 C114.1 IC14.3(AGND) IC14.6(AGND) IC14.9(AGND) IC14.12(LGND) IC14.13(PDN) IC14.14(LGND) IC14.36(LGND) IC14.37(AGND) IC14.40(AGND) IC14.43(AGND) IC14.46(AGND) IC14.56(INTERLEAVE_MUX) IC14.65(EP) IC15.3(GND)
P1V8: C93.2 C114.2 IC14.35(LVDD) IC15.5(VCC) L7.1
ADC_CLK_N: C98.1 R47.1 ; port ADC_CLK.CLK_N
ADC_CLK_P: C97.1 R47.2 ; port ADC_CLK.CLK_P
ADC_RESETn_1V8: IC14.64(~{RESET}) ; port ADC_RESETn_1V8
ADCLK_N: IC14.24(ADCLKN) ; port ADC_OUT.ADCLK_N
ADCLK_P: IC14.23(ADCLKP) ; port ADC_OUT.ADCLK_P
IN0_N: IC14.11(IN4_N) ; port IN0.SIG_N
IN0_P: IC14.10(IN4_P) ; port IN0.SIG_P
IN1_N: IC14.8(IN3_N) ; port IN1.SIG_N
IN1_P: IC14.7(IN3_P) ; port IN1.SIG_P
IN2_N: IC14.5(IN2_N) ; port IN2.SIG_N
IN2_P: IC14.4(IN2_P) ; port IN2.SIG_P
IN3_N: IC14.2(IN1_N) ; port IN3.SIG_N
IN3_P: IC14.1(IN1_P) ; port IN3.SIG_P
IN4_N: IC14.48(IN8_N) ; port IN4.SIG_N
IN4_P: IC14.47(IN8_P) ; port IN4.SIG_P
IN5_N: IC14.45(IN7_N) ; port IN5.SIG_N
IN5_P: IC14.44(IN7_P) ; port IN5.SIG_P
IN6_N: IC14.42(IN6_N) ; port IN6.SIG_N
IN6_P: IC14.41(IN6_P) ; port IN6.SIG_P
IN7_N: IC14.39(IN5_N) ; port IN7.SIG_N
IN7_P: IC14.38(IN5_P) ; port IN7.SIG_P
LCLK_N: IC14.26(LCLKN) ; port ADC_OUT.LCLK_N
LCLK_P: IC14.25(LCLKP) ; port ADC_OUT.LCLK_P
MISO: IC15.4(OUT) ; port SPI_1V8.MISO
MOSI: IC14.62(SDATA) ; port SPI_1V8.MOSI
OUT0_N: IC14.16(OUT1_N) ; port ADC_OUT.OUT0_N
OUT0_P: IC14.15(OUT1_P) ; port ADC_OUT.OUT0_P
OUT1_N: IC14.18(OUT2_N) ; port ADC_OUT.OUT1_N
OUT1_P: IC14.17(OUT2_P) ; port ADC_OUT.OUT1_P
OUT2_N: IC14.20(OUT3_N) ; port ADC_OUT.OUT2_N
OUT2_P: IC14.19(OUT3_P) ; port ADC_OUT.OUT2_P
OUT3_N: IC14.22(OUT4_N) ; port ADC_OUT.OUT3_N
OUT3_P: IC14.21(OUT4_P) ; port ADC_OUT.OUT3_P
OUT4_N: IC14.28(OUT5_N) ; port ADC_OUT.OUT4_N
OUT4_P: IC14.27(OUT5_P) ; port ADC_OUT.OUT4_P
OUT5_N: IC14.30(OUT6_N) ; port ADC_OUT.OUT5_N
OUT5_P: IC14.29(OUT6_P) ; port ADC_OUT.OUT5_P
OUT6_N: IC14.32(OUT7_N) ; port ADC_OUT.OUT6_N
OUT6_P: IC14.31(OUT7_P) ; port ADC_OUT.OUT6_P
OUT7_N: IC14.34(OUT8_N) ; port ADC_OUT.OUT7_N
OUT7_P: IC14.33(OUT8_P) ; port ADC_OUT.OUT7_P
SCK: IC14.63(SCLK) ; port SPI_1V8.SCK
SSN: IC14.61(~{CS}) IC15.1(~{G}) ; port SPI_1V8.SSN
SYNC_1V8: IC14.49(SYNC) ; port SYNC_1V8
VCM: IC14.53(VCM) ; port VCM
NetC92_1: C92.1 C94.2 C95.2 C96.2 IC14.50(AVDD) IC14.57(AVDD) IC14.60(AVDD) L7.2
NetC97_2: C97.2 IC14.58(CLKP)
NetC98_2: C98.2 IC14.59(CLKN)
NetIC14_52: IC14.52(SDOUT) IC15.2(IN)

Not connected (* = marked no-connect by the designer): IC14 51(NC)* 54(REFB)* 55(REFT)*

### Channels
U_ADC0: designators end in A; ports ADC_RESETn_1V8=ADC_RESETn_1V8 SYNC_1V8=ADC_SYNC_1V8 VCM=VCM0
U_ADC1: designators end in B; ports ADC_RESETn_1V8=ADC_RESETn_1V8 SYNC_1V8=ADC_SYNC_1V8 VCM=VCM1

### Layout directives
differential pair: ADC_CLK_N, ADC_CLK_P, ADC_IN0.SIG_N, ADC_IN0.SIG_P, ADC_IN1.SIG_N, ADC_IN1.SIG_P, ADC_IN2.SIG_N, ADC_IN2.SIG_P, ADC_IN3.SIG_N, ADC_IN3.SIG_P, ADC_IN4.SIG_N, ADC_IN4.SIG_P, ADC_IN5.SIG_N, ADC_IN5.SIG_P, ADC_IN6.SIG_N, ADC_IN6.SIG_P, ADC_IN7.SIG_N, ADC_IN7.SIG_P, ADCLK_N, ADCLK_P, HB01_N, HB01_P, HB02_N, HB02_P, HB03_N, HB03_P, HB04_N, HB04_P, HB05_N, HB05_P, HB06_CC_N, HB06_CC_P, HB07_N, HB07_P, HB08_N, HB08_P, HB09_N, HB09_P

### Notes on the sheet
- SWAPPED CHANNELS
- (near IC14) SWAPPED CHANNELS
- ADS5296 has strange SPI mode where SDO Hi-Z is programmable. To make sure it won't cause issues later, 3-state buffer was added
- Project/Equipment
- Document
- Designer
- Drawn by
- Check.by
- Copyright WUT ISE 2018.
  This documentation describes Open Hardware and is licensed under the CERN OHL v.1.1. You may redistribute and modify this documentation under the terms of the CERN OHL v.1.1. (http://ohwr.org/CERNOHL). This documentation is distributed WITHOUT ANY EXPRESS OR IMPLIED WARRANTY, INCLUDING OF MERCHANTABILITY, SATISFACTORY QUALITY AND FITNESS FOR A PARTICULAR PURPOSE. Please see the CERN OHL v.1.1 for applicable conditions.
- Contact
- File
- Last Mod.
- Print Date
- Sheet
- Size
- A3
- of
- Rev
- (in symbol CTE3216-18_33UF_4V_10%) +
- (in symbol R0201_100R_1%_0.05W_200PPM) 1%

### Library data of the parts
C92 = CTE3216-18_33UF_4V_10%: Polarised capacitor; Part Description: Solid Tantalum Chip Capacitor; Manufacturer: GENERIC; Manufacturer1 Part Number: TAJA336K004R; Voltage: 4V; Tolerance: ±10%; Part Number: CTE3216-18_33UF_4V_10%; Component Kind: Standard; Component Type: Standard; Pin Count: 2; Value: 33uF; Status: Preferred; Manufacturer Part Number: CTE3216-18_33UF_4V_10%; Case: A; Mounted: Yes; Socket: No; SMD: Yes; Sense: No; Manufacturer1 Example: AVX; Manufacturer1 ComponentHeight: 1.8mm; HelpURL: \\cern.ch\dfs\Applications\Altium\Datasheets\CTE_AVX_TAJ.pdf; Author: CERN DEM JLC; CreateDate: 03.12.2007; LatestRevisionDate: 03.12.2007
C93-C98 C114 = CC0201_100NF_6.3V_10%_X5R: Non-polarised capacitor; Part Description: SMD Multilayer Chip Ceramic Capacitor; Manufacturer: GENERIC; Manufacturer1 Part Number: 02016D104KAT2A; Voltage: 6.3V; TC: X5R; Tolerance: ±10%; Part Number: CC0201_100NF_6.3V_10%_X5R; Component Kind: Standard; Component Type: Standard; Pin Count: 2; Value: 100nF; Status: Not Recommended; Manufacturer Part Number: CC0201_100NF_6.3V_10%_X5R; Case: 0201; Mounted: Yes; Socket: No; SMD: Yes; Sense: No; Manufacturer1 Example: AVX; Manufacturer1 ComponentHeight: 0.33mm; HelpURL: \\cern.ch\dfs\Applications\Altium\Datasheets\CC0201_X5R_AVX.pdf; Author: CERN DEM JLC; CreateDate: 03.12.2007; LatestRevisionDate: 03.12.2007
IC14 = ADS5296ARGC: 10-Bit, 200-MSPS, 4-Channel and 12-Bit, 80-MSPS, 8-Channel ADC; Manufacturer: TEXAS INSTRUMENTS; PressFit: No; Bonding: No; Part Number: ADS5296ARGC; Component Kind: Standard; Component Type: Standard; Device: ADS5296ARGC; PackageDescription: QFN, 0.50mm Pitch, Square; 64 Pin, 9.00mm L X 9.00mm W X 1.00mm H Body (7.35 X 7.35mm Thermal Tab), IPC Medium Density; Part Description: 10-Bit, 200-MSPS, 4-Channel and 12-Bit, 80-MSPS, 8-Channel ADC; Manufacturer Part Number: ADS5296ARGC; Pin Count: 65; Case: QFN64; Mounted: Yes; Socket: No; SMD: Yes; Sense: No; ComponentHeight: 1mm; Author: CERN DEM MR; HelpURL: \\cern.ch\dfs\Applications\Altium\Datasheets\ADS5296ARGC.pdf; CreateDate: 23.04.2019; LatestRevisionDate: 23.04.2019
IC15 = SN74LV1T125DCKR: Single Power Supply Single Buffer Gate with 3-State Output CMOS Logic Level Shifter; Manufacturer: TEXAS INSTRUMENTS; PressFit: No; Bonding: No; Part Number: SN74LV1T125DCKR; Component Kind: Standard; Component Type: Standard; Device: SN74LV1T125DCKR; PackageDescription: SOT353, SC70-5, SOT, 0.65mm Pitch, 5 pin, 1.25mm W X 2.00mm L X 1.10mm H, IPC Medium Density; Part Description: Single Power Supply Single Buffer Gate with 3-State Output CMOS Logic Level Shifter; Manufacturer Part Number: SN74LV1T125DCKR; Pin Count: 5; Case: SOT353; Mounted: Yes; Socket: No; SMD: Yes; Sense: No; ComponentHeight: 1.1mm; Author: CERN DEM JLC; HelpURL: \\cern.ch\dfs\Applications\Altium\Datasheets\SN74LV1T125DCKR.pdf; CreateDate: 13.06.2018; LatestRevisionDate: 13.06.2018
L7 = IND0402_MURATA_BLM15HD601SN1: Part Description: SMD EMIFIL Suppression Chip Ferrite Bead; Manufacturer: MURATA; Manufacturer Part Number: BLM15HD601SN1D; Power: 300mA; Resistance: 0.85R; Tolerance: ±25%; Part Number: IND0402_MURATA_BLM15HD601SN1; Component Kind: Standard; Component Type: Standard; Pin Count: 2; Value: 600R@100MHz; Status: None; Case: 0402; Mounted: Yes; Socket: No; SMD: Yes; Sense: No; ComponentHeight: 0.55mm; HelpURL: \\cern.ch\dfs\Applications\Altium\Datasheets\IND0402_MURATA_BLM15H.pdf; Author: CERN DEM JLC; CreateDate: 28.02.2012; LatestRevisionDate: 25.10.2018
R47 = R0201_100R_1%_0.05W_200PPM: Resistor - 1%; Part Description: Thick Film Chip Resistor; Manufacturer: GENERIC; Manufacturer1 Part Number: CRCW0201100RFNED; Power: 0.05W; TC: ±200ppm/°C; PressFit: No; Part Number: R0201_100R_1%_0.05W_200PPM; Component Kind: Standard; Component Type: Standard; Pin Count: 2; Value: 100; Status: Not Recommended; Tolerance: ±1%; Manufacturer Part Number: R0201_100R_1%_0.05W_200PPM; Case: 0201; Mounted: Yes; Sense: No; Socket: No; SMD: Yes; Manufacturer1 Example: VISHAY; Manufacturer1 ComponentHeight: 0.27mm; HelpURL: \\cern.ch\dfs\Applications\Altium\Datasheets\R0201_VISHAY_CRCW0201 e3.pdf; Author: CERN DEM JLC; CreateDate: 13.11.2014; LatestRevisionDate: 13.11.2014

## Sheet TDC.SchDoc: FMC_ADC
size 420 x 297 mm; Author: G.Kasprowicz; CompanyName: WUT ISE; DrawnBy: G.Kasprowicz; Organization: WUT ISE; Address1: PW ISE; Address2: Nowowiejska 15/19 00-665 Warsaw; Address3: gkasprow@gmail.com; DocumentNumber: 4; Revision: 2; SheetNumber: 4; SheetTotal: 12; ModifiedBy: -; CheckedDate: -; Title2: quad TDC; DivGrp: WUT ISE; Designer: G.Kasprowicz; ModifiedDate: -; ProjectName: Sensor Box
Used 4 times, as channels U_TDC0, U_TDC1, U_TDC2, U_TDC3. Parts and nets are listed once, with the designators drawn on the sheet.
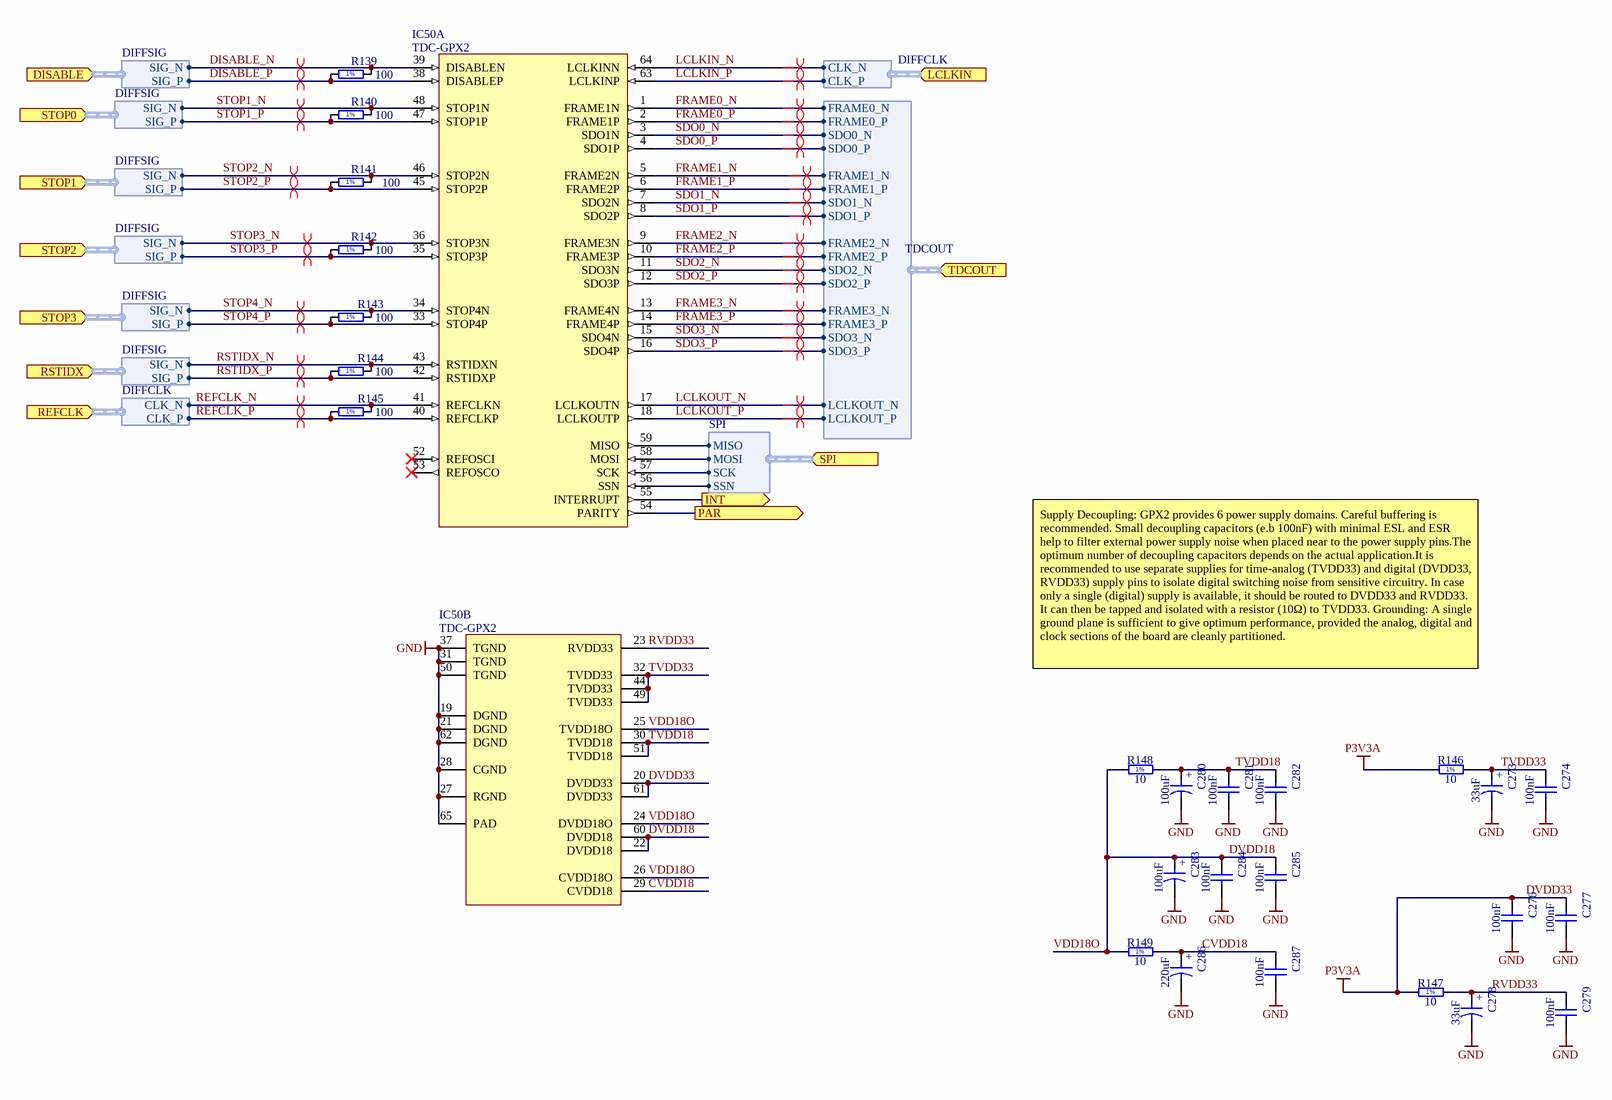
[diagram p2: TDC.SchDoc]

### Parts
C273  33uF  [CAPMP3216X180N]
C274  100nF  [CAPC0603X33N]
C276  100nF  [CAPC0603X33N]
C277  100nF  [CAPC0603X33N]
C278  33uF  [CAPMP3216X180N]
C279  100nF  [CAPC0603X33N]
C280  100uF  [CAPMP3216X180N]
C281  100nF  [CAPC0603X33N]
C282  100nF  [CAPC0603X33N]
C283  100uF  [CAPMP3216X180N]
C284  100nF  [CAPC0603X33N]
C285  100nF  [CAPC0603X33N]
C286  220uF  [CAPMP3528X210N]
C287  100nF  [CAPC0603X33N]
IC50  TDC-GPX2  [QFN50P900X900X100-65N-S615]  (parts A,B of 2)
R139  100  [RESC0603X28N]
R140  100  [RESC0603X28N]
R141  100  [RESC0603X28N]
R142  100  [RESC0603X28N]
R143  100  [RESC0603X28N]
R144  100  [RESC0603X28N]
R145  100  [RESC0603X28N]
R146  10  [RESC1005X40N]
R147  10  [RESC1005X40N]
R148  10  [RESC1005X40N]
R149  10  [RESC1005X40N]

### Ports
DISABLE (in, harness DIFFSIG), INT (out), LCLKIN (in, harness DIFFCLK), PAR (out), REFCLK (in, harness DIFFCLK), RSTIDX (in, harness DIFFSIG), SPI (in, harness SPI), STOP0 (in, harness DIFFSIG), STOP1 (in, harness DIFFSIG), STOP2 (in, harness DIFFSIG), STOP3 (in, harness DIFFSIG), TDCOUT (in, harness TDCOUT)

### Harnesses
DIFFCLK: CLK_P, CLK_N
TDCOUT: FRAME0_N, FRAME0_P, SDO0_N, SDO0_P, FRAME1_N, FRAME1_P, SDO1_N, SDO1_P, FRAME2_N, FRAME2_P, SDO2_N, SDO2_P, FRAME3_N, FRAME3_P, SDO3_N, SDO3_P, LCLKOUT_N, LCLKOUT_P
SPI: MISO, MOSI, SCK, SSN
DIFFSIG: SIG_P, SIG_N

### Nets
DVDD33: C276.1 C277.1 IC50.20(DVDD33) IC50.61(DVDD33) R146.1 R147.1  [also labelled P3V3A]
GND: C273.2 C274.2 C276.2 C277.2 C278.2 C279.2 C280.2 C281.2 C282.2 C283.2 C284.2 C285.2 C286.2 C287.2 IC50.19(DGND) IC50.21(DGND) IC50.27(RGND) IC50.28(CGND) IC50.31(TGND) IC50.37(TGND) IC50.50(TGND) IC50.62(DGND) IC50.65(PAD)
CVDD18: C286.1 C287.1 IC50.29(CVDD18) R149.2
DISABLE_N: IC50.39(DISABLEN) R139.2 ; port DISABLE.SIG_N
DISABLE_P: IC50.38(DISABLEP) R139.1 ; port DISABLE.SIG_P
DVDD18: C283.1 C284.1 C285.1 IC50.22(DVDD18) IC50.24(DVDD18O) IC50.25(TVDD18O) IC50.26(CVDD18O) IC50.60(DVDD18) R148.1 R149.1  [also labelled VDD18O]
FRAME0_N: IC50.1(FRAME1N) ; port TDCOUT.FRAME0_N
FRAME0_P: IC50.2(FRAME1P) ; port TDCOUT.FRAME0_P
FRAME1_N: IC50.5(FRAME2N) ; port TDCOUT.FRAME1_N
FRAME1_P: IC50.6(FRAME2P) ; port TDCOUT.FRAME1_P
FRAME2_N: IC50.9(FRAME3N) ; port TDCOUT.FRAME2_N
FRAME2_P: IC50.10(FRAME3P) ; port TDCOUT.FRAME2_P
FRAME3_N: IC50.13(FRAME4N) ; port TDCOUT.FRAME3_N
FRAME3_P: IC50.14(FRAME4P) ; port TDCOUT.FRAME3_P
INT: IC50.55(INTERRUPT) ; port INT
LCLKIN_N: IC50.64(LCLKINN) ; port LCLKIN.CLK_N
LCLKIN_P: IC50.63(LCLKINP) ; port LCLKIN.CLK_P
LCLKOUT_N: IC50.17(LCLKOUTN) ; port TDCOUT.LCLKOUT_N
LCLKOUT_P: IC50.18(LCLKOUTP) ; port TDCOUT.LCLKOUT_P
PAR: IC50.54(PARITY) ; port PAR
REFCLK_N: IC50.41(REFCLKN) R145.2 ; port REFCLK.CLK_N
REFCLK_P: IC50.40(REFCLKP) R145.1 ; port REFCLK.CLK_P
RSTIDX_N: IC50.43(RSTIDXN) R144.2 ; port RSTIDX.SIG_N
RSTIDX_P: IC50.42(RSTIDXP) R144.1 ; port RSTIDX.SIG_P
RVDD33: C278.1 C279.1 IC50.23(RVDD33) R147.2
SDO0_N: IC50.3(SDO1N) ; port TDCOUT.SDO0_N
SDO0_P: IC50.4(SDO1P) ; port TDCOUT.SDO0_P
SDO1_N: IC50.7(SDO2N) ; port TDCOUT.SDO1_N
SDO1_P: IC50.8(SDO2P) ; port TDCOUT.SDO1_P
SDO2_N: IC50.11(SDO3N) ; port TDCOUT.SDO2_N
SDO2_P: IC50.12(SDO3P) ; port TDCOUT.SDO2_P
SDO3_N: IC50.15(SDO4N) ; port TDCOUT.SDO3_N
SDO3_P: IC50.16(SDO4P) ; port TDCOUT.SDO3_P
STOP1_N: IC50.48(STOP1N) R140.2 ; port STOP0.SIG_N
STOP1_P: IC50.47(STOP1P) R140.1 ; port STOP0.SIG_P
STOP2_N: IC50.46(STOP2N) R141.2 ; port STOP1.SIG_N
STOP2_P: IC50.45(STOP2P) R141.1 ; port STOP1.SIG_P
STOP3_N: IC50.36(STOP3N) R142.2 ; port STOP2.SIG_N
STOP3_P: IC50.35(STOP3P) R142.1 ; port STOP2.SIG_P
STOP4_N: IC50.34(STOP4N) R143.2 ; port STOP3.SIG_N
STOP4_P: IC50.33(STOP4P) R143.1 ; port STOP3.SIG_P
TVDD18: C280.1 C281.1 C282.1 IC50.30(TVDD18) IC50.51(TVDD18) R148.2
TVDD33: C273.1 C274.1 IC50.32(TVDD33) IC50.44(TVDD33) IC50.49(TVDD33) R146.2
NetIC50_56: IC50.56(SSN) ; port SPI.SSN
NetIC50_57: IC50.57(SCK) ; port SPI.SCK
NetIC50_58: IC50.58(MOSI) ; port SPI.MOSI
NetIC50_59: IC50.59(MISO) ; port SPI.MISO

Not connected (* = marked no-connect by the designer): IC50 52(REFOSCI)* 53(REFOSCO)*

### Channels
U_TDC0: designators end in A; ports INT=TDC_INT0 PAR=TDC_PAR0
U_TDC1: designators end in B; ports INT=TDC_INT1 PAR=TDC_PAR1
U_TDC2: designators end in C; ports INT=TDC_INT2 PAR=TDC_PAR2
U_TDC3: designators end in D; ports INT=TDC_INT3 PAR=TDC_PAR3

### Layout directives
differential pair: CFD_OUT0.SIG_N, CFD_OUT0.SIG_P, CFD_OUT1.SIG_N, CFD_OUT1.SIG_P, CFD_OUT2.SIG_N, CFD_OUT2.SIG_P, CFD_OUT3.SIG_N, CFD_OUT3.SIG_P, DISABLE_N, DISABLE_P, FRAME0_N, FRAME0_P, FRAME1_N, FRAME1_P, FRAME2_N, FRAME2_P, FRAME3_N, FRAME3_P, HB13_N, HB13_P, HB16_N, HB16_P, HB17_CC_N, HB17_CC_P, HB18_N, HB18_P, HB19_N, HB19_P, IDX0.SIG_N, IDX0.SIG_P, LCLKIN_N, LCLKIN_P, REFCLK_N, REFCLK_P

### Notes on the sheet
- Supply Decoupling: GPX2 provides 6 power supply domains. Careful buffering is recommended. Small decoupling capacitors (e.b 100nF) with minimal ESL and ESR help to filter external power supply noise when placed near to the power supply pins.The optimum number of decoupling capacitors depends on the actual application.It is recommended to use separate supplies for time-analog (TVDD33) and digital (DVDD33, RVDD33) supply pins to isolate digital switching noise from sensitive circuitry. In case only a single (digital) supply is available, it should be routed to DVDD33 and RVDD33. It can then be tapped and isolated with a resistor (10Ω) to TVDD33. Grounding: A single ground plane is sufficient to give optimum performance, provided the analog, digital and clock sections of the board are cleanly partitioned.
- Project/Equipment
- Document
- Designer
- Drawn by
- Check.by
- Copyright WUT ISE 2018.
  This documentation describes Open Hardware and is licensed under the CERN OHL v.1.1. You may redistribute and modify this documentation under the terms of the CERN OHL v.1.1. (http://ohwr.org/CERNOHL). This documentation is distributed WITHOUT ANY EXPRESS OR IMPLIED WARRANTY, INCLUDING OF MERCHANTABILITY, SATISFACTORY QUALITY AND FITNESS FOR A PARTICULAR PURPOSE. Please see the CERN OHL v.1.1 for applicable conditions.
- Contact
- File
- Last Mod.
- Print Date
- Sheet
- Size
- A3
- of
- Rev
- (in symbol CTE3216-18_33UF_4V_10%) +
- (in symbol CTE3216-18_100UF_6.3V_20%_ESR0500_AVX_TLJ) +
- (in symbol CTE3528-21_220UF_2.5V_10%) +
- (in symbol R0201_100R_1%_0.05W_200PPM) 1%
- (in symbol R0402_10R_1%_0.0625W_200PPM) 1%

### Library data of the parts
C273 C278 = CTE3216-18_33UF_4V_10%: as C92 on sheet ADC_8CH; Part Number: CTE3216-18_33UF_4V_10%; Component Kind: Standard; Component Type: Standard; Pin Count: 2; Value: 33uF; Status: Preferred; Manufacturer Part Number: CTE3216-18_33UF_4V_10%; Case: A; Mounted: Yes; Socket: No; SMD: Yes; Sense: No; Manufacturer1 Example: AVX; Manufacturer1 ComponentHeight: 1.8mm; HelpURL: \\cern.ch\dfs\Applications\Altium\Datasheets\CTE_AVX_TAJ.pdf; Author: CERN DEM JLC; CreateDate: 03.12.2007; LatestRevisionDate: 03.12.2007
C274 C276 C279 C281 C282 C284 C287 = CC0201_100NF_6.3V_10%_X5R: as C93 on sheet ADC_8CH; Part Number: CC0201_100NF_6.3V_10%_X5R; Component Kind: Standard; Component Type: Standard; Pin Count: 2; Value: 100nF; Status: Not Recommended; Manufacturer Part Number: CC0201_100NF_6.3V_10%_X5R; Case: 0201; Mounted: Yes; Socket: No; SMD: Yes; Sense: No; Manufacturer1 Example: AVX; Manufacturer1 ComponentHeight: 0.33mm; HelpURL: \\cern.ch\dfs\Applications\Altium\Datasheets\CC0201_X5R_AVX.pdf; Author: CERN DEM JLC; CreateDate: 03.12.2007; LatestRevisionDate: 03.12.2007
C277 C285 = CC0201_100NF_6.3V_10%_X5R: Non-polarised capacitor; Part Description: SMD Multilayer Chip Ceramic Capacitor; Manufacturer: GENERIC; Manufacturer1 Part Number: 02016D104KAT2A; Voltage: 6.3V; Tolerance: ±10%; TC: X5R; Part Number: CC0201_100NF_6.3V_10%_X5R; Component Kind: Standard; Component Type: Standard; Pin Count: 2; Value: 100nF; Status: Not Recommended; Manufacturer Part Number: CC0201_100NF_6.3V_10%_X5R; Case: 0201; Mounted: Yes; Socket: No; SMD: Yes; Sense: No; Manufacturer1 Example: AVX; Manufacturer1 ComponentHeight: 0.33mm; HelpURL: \\cern.ch\dfs\Applications\Altium\Datasheets\CC0201_X5R_AVX.pdf; Author: CERN DEM JLC; CreateDate: 03.12.2007; LatestRevisionDate: 03.12.2007
C280 C283 = CTE3216-18_100UF_6.3V_20%_ESR0500_AVX_TLJ: Polarised capacitor; Part Description: ESR 0R5 Solid Tantalum Chip Capacitor; Manufacturer: AVX; Manufacturer Part Number: TLJA107M006R0500; Voltage: 6.3V; Tolerance: ±20%; Part Number: CTE3216-18_100UF_6.3V_20%_ESR0500_AVX_TLJ; Component Kind: Standard; Component Type: Standard; Pin Count: 2; Value: 100uF; Status: None; Case: A; Mounted: Yes; Socket: No; SMD: Yes; Sense: No; ComponentHeight: 1.8mm; HelpURL: \\cern.ch\dfs\Applications\Altium\Datasheets\CTE_AVX_TLJ.pdf; Author: CERN DEM JLC; CreateDate: 19.12.2013; LatestRevisionDate: 19.12.2013
C286 = CTE3528-21_220UF_2.5V_10%: Polarised capacitor; Part Description: Solid Tantalum Chip Capacitor; Manufacturer: GENERIC; Manufacturer1 Part Number: TAJB227K002R; Voltage: 2.5V; Tolerance: ±10%; Part Number: CTE3528-21_220UF_2.5V_10%; Component Kind: Standard; Component Type: Standard; Pin Count: 2; Value: 220uF; Status: Preferred; Manufacturer Part Number: CTE3528-21_220UF_2.5V_10%; Case: B; Mounted: Yes; Socket: No; SMD: Yes; Sense: No; Manufacturer1 Example: AVX; Manufacturer1 ComponentHeight: 2.1mm; HelpURL: \\cern.ch\dfs\Applications\Altium\Datasheets\CTE_AVX_TAJ.pdf; Author: CERN DEM JLC; CreateDate: 03.12.2007; LatestRevisionDate: 03.12.2007
IC50 = TDC-GPX2: 4-Channel Time-to-Digital Converter; Manufacturer: ACAM MESS-ELECTRONIC; PressFit: No; Bonding: No; Part Number: TDC-GPX2; Component Kind: Standard; Component Type: Standard; Device: TDC-GPX2; PackageDescription: QFN,0.50mm pitch,square;64 pin,9.00mm L X 9.00mm W X 1.00mm H body (6.15mm X 6.15mm thermal tab), IPC Medium Density; Part Description: 4-Channel Time-to-Digital Converter; Manufacturer Part Number: TDC-GPX2; Pin Count: 65; Case: QFN64; Mounted: Yes; Socket: No; SMD: Yes; Sense: No; ComponentHeight: 1.2mm; Author: GK; HelpURL: \\cern.ch\dfs\Applications\Altium\Datasheets\TDC-GPX.pdf; CreateDate: 05.07.2010; LatestRevisionDate: 05.07.2010
R139-R145 = R0201_100R_1%_0.05W_200PPM: as R47 on sheet ADC_8CH; Part Number: R0201_100R_1%_0.05W_200PPM; Component Kind: Standard; Component Type: Standard; Pin Count: 2; Value: 100; Status: Not Recommended; Tolerance: ±1%; Manufacturer Part Number: R0201_100R_1%_0.05W_200PPM; Case: 0201; Mounted: Yes; Sense: No; Socket: No; SMD: Yes; Manufacturer1 Example: VISHAY; Manufacturer1 ComponentHeight: 0.27mm; HelpURL: \\cern.ch\dfs\Applications\Altium\Datasheets\R0201_VISHAY_CRCW0201 e3.pdf; Author: CERN DEM JLC; CreateDate: 13.11.2014; LatestRevisionDate: 13.11.2014
R146-R149 = R0402_10R_1%_0.0625W_200PPM: Resistor - 1%; Part Description: General Purpose Thick Film Chip Resistor; Manufacturer: GENERIC; Manufacturer1 Part Number: 232270671009L; TC: ±200ppm/°C; PressFit: No; Part Number: R0402_10R_1%_0.0625W_200PPM; Component Kind: Standard; Component Type: Standard; Pin Count: 2; Value: 10; Status: Not Recommended; Power: 0.0625W; Tolerance: ±1%; Manufacturer Part Number: R0402_10R_1%_0.0625W_200PPM; Case: 0402; Mounted: Yes; Sense: No; Socket: No; SMD: Yes; Manufacturer1 Example: YAGEO PHYCOMP; Manufacturer1 ComponentHeight: 0.4mm; HelpURL: \\cern.ch\dfs\Applications\Altium\Datasheets\R0402_Phycomp_RC0402.pdf; Author: CERN DEM JLC; CreateDate: 24.06.2009; LatestRevisionDate: 17.10.2012